# Altium schematic sheet Power.SchDoc
size A4
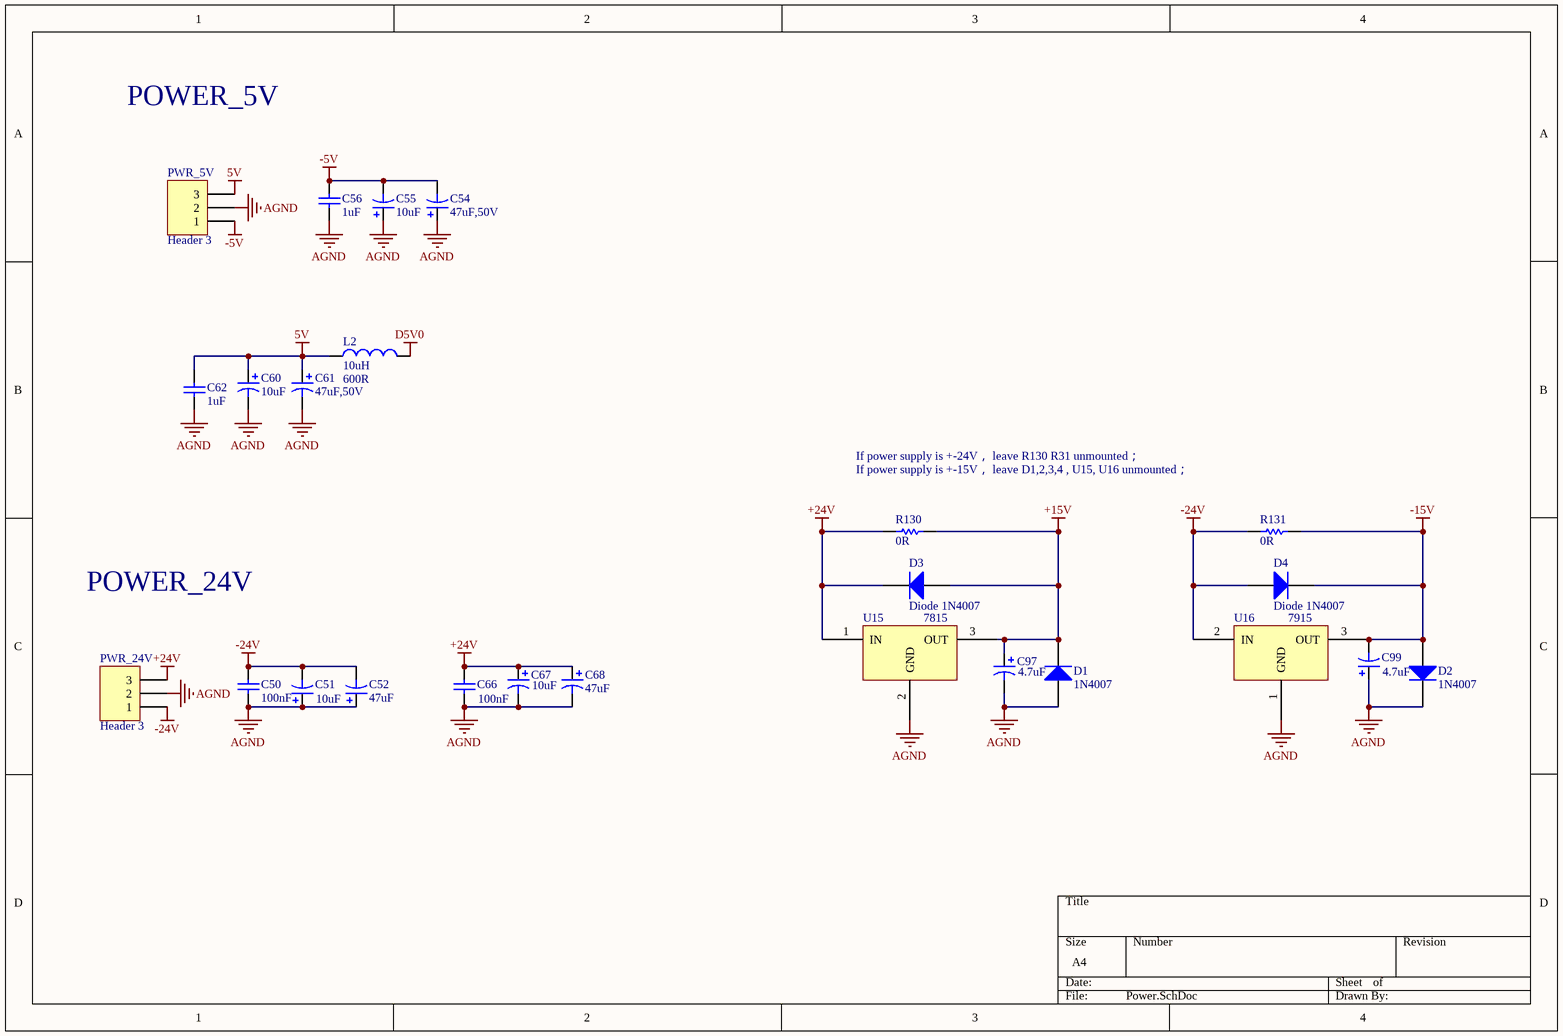
[diagram p0: Power.SchDoc]

## Parts
C50  100nF  [0805]
C51  10uF  [6032_pol]
C52  47uF  [cap_pol_8*10.2]
C54  47uF,50V  [cap_pol_8*10.2]
C55  10uF  [6032_pol]
C56  1uF  [0805]
C60  10uF  [6032_pol]
C61  47uF,50V  [cap_pol_8*10.2]
C62  1uF  [0805]
C66  100nF  [0805]
C67  10uF  [6032_pol]
C68  47uF  [cap_pol_8*10.2]
C97  4.7uF  [6032_pol]
C99  4.7uF  [6032_pol]
D1  1N4007  [1N4007_M7]
D2  1N4007  [1N4007_M7]
D3  Diode 1N4007  [1N4007_M7]
D4  Diode 1N4007  [1N4007_M7]
L2  10uH  value 600R  [8040]
PWR_5V  Header 3  [PWR_3T]
PWR_24V  Header 3  [PWR_3T]
R130  0R  [1206]
R131  0R  [1206]
U15  7815  [TO-220]
U16  7915  [TO-220]

## Nets
5V: C60.1 C61.1 C62.2 L2.1 PWR_5V.3
+15V: C97.1 D1.2(K) D3.1(A) R130.2 U15.3(OUT)
+24V: C66.1 C67.1 C68.1 D3.2(K) PWR_24V.3 R130.1 U15.1(IN)
-5V: C54.2 C55.2 C56.2 PWR_5V.1
-15V: C99.2 D2.1(A) D4.2(K) R131.2 U16.3(OUT)
-24V: C50.1 C51.2 C52.2 D4.1(A) PWR_24V.1 R131.1 U16.2(IN)
AGND: C50.2 C51.1 C52.1 C54.1 C55.1 C56.1 C60.2 C61.2 C62.1 C66.2 C67.2 C68.2 C97.2 C99.1 D1.1(A) D2.2(K) PWR_5V.2 PWR_24V.2 U15.2(GND) U16.1(GND)
D5V0: L2.2

## Notes on the sheet
- POWER_5V
- If power supply is +-24V， leave R130 R31 unmounted；
- If power supply is +-15V， leave D1,2,3,4 , U15, U16 unmounted；
- POWER_24V

## Library data of the parts
C50 C66 = Cap: Capacitor; Published: 8-Jun-2000; LatestRevisionDate: 17-Jul-2002; LatestRevisionNote: Re-released for DXP Platform.; PackageReference: RAD-0.3; Publisher: Altium Limited; PackageDescription: Radial Cap, Thru-Hole; 2 Leads; 0.3 in Pin Spacing; Value: 100nF
C51 C67 = Cap Pol1: Polarized Capacitor (Radial); Value: 10uF,35V; Published: 8-Jun-2000; LatestRevisionDate: 17-Jul-2002; LatestRevisionNote: Re-released for DXP Platform.; PackageReference: RB7.6-15; Publisher: Altium Limited; PackageDescription: Polarized Capacitor (Radial); 2 Leads
C52 C54 C55 C60 C61 C68 = Cap Pol1: Polarized Capacitor (Radial); Published: 8-Jun-2000; LatestRevisionDate: 17-Jul-2002; LatestRevisionNote: Re-released for DXP Platform.; PackageReference: RB7.6-15; Publisher: Altium Limited; PackageDescription: Polarized Capacitor (Radial); 2 Leads
  C52 C54 C61 C68: Value: 47uF
  C55 C60: Value: 10uF
C56 C62 = Cap: Capacitor,100V; Published: 8-Jun-2000; LatestRevisionDate: 17-Jul-2002; LatestRevisionNote: Re-released for DXP Platform.; PackageReference: RAD-0.3; Publisher: Altium Limited; PackageDescription: Radial Cap, Thru-Hole; 2 Leads; 0.3 in Pin Spacing; Value: 1uF
C97 C99 = Cap Pol1: Polarized Capacitor (Radial); Value: 4.7uF,35V; Published: 8-Jun-2000; LatestRevisionDate: 17-Jul-2002; LatestRevisionNote: Re-released for DXP Platform.; PackageReference: RB7.6-15; Publisher: Altium Limited; PackageDescription: Polarized Capacitor (Radial); 2 Leads
D1-D4 = Diode 1N4007: 1 Amp General Purpose Rectifier; Published: 8-Jun-2000; LatestRevisionDate: 17-Jul-2002; LatestRevisionNote: Re-released for DXP Platform.; DatasheetVersion: 1998; PackageVersion: Aug-1999; PackageReference: DO-41; Publisher: Altium Limited; PackageDescription: Diode, Axial; Body 5.2 x 2.7 mm (LxDia. max), Lead Dia. 0.86 mm (max); Code_JEDEC: DO-204-AL; ComponentLink1Description: Manufacturer Link; ComponentLink1URL: http://www.fairchildsemi.com/; ComponentLink2Description: Datasheet; ComponentLink2URL: http://www.fairchildsemi.com/ds/1N%2F1N4001.pdf
L2 = Inductor: Code_IEC: 1005; Published: 8-Jun-2000; LatestRevisionDate: 29-May-2009; LatestRevisionNote: IPC-7351 Footprint Added.; PackageReference: 0402-A; Publisher: Altium Limited; PackageDescription: Chip Inductor; Code_JEITA: 0402
PWR_5V PWR_24V = Header 3: Header, 3-Pin; LatestRevisionDate: 17-Jul-2002; LatestRevisionNote: Re-released for DXP Platform.; Publisher: Altium Limited
R130 R131 = Res1: Resistor; Published: 8-Jun-2000; LatestRevisionDate: 17-Jul-2002; LatestRevisionNote: Re-released for DXP Platform.; PackageReference: AXIAL-0.3; Publisher: Altium Limited